# Altium schematic sheet mcu.SchDoc: MJVESC MINI - MCU
size A3; Author: Dongil Choi; Organization: DRC LAB, Myongji University; Address1: Engineering Building 1, #214; Address2: 116 Myongji-ro, Cheoin-Gu; Address3: Yongin-si, Gyeonggi-Do; Address4: South Korea, 17058; DocumentNumber: 1; Revision: 0.3A; SheetNumber: 1; SheetTotal: 3
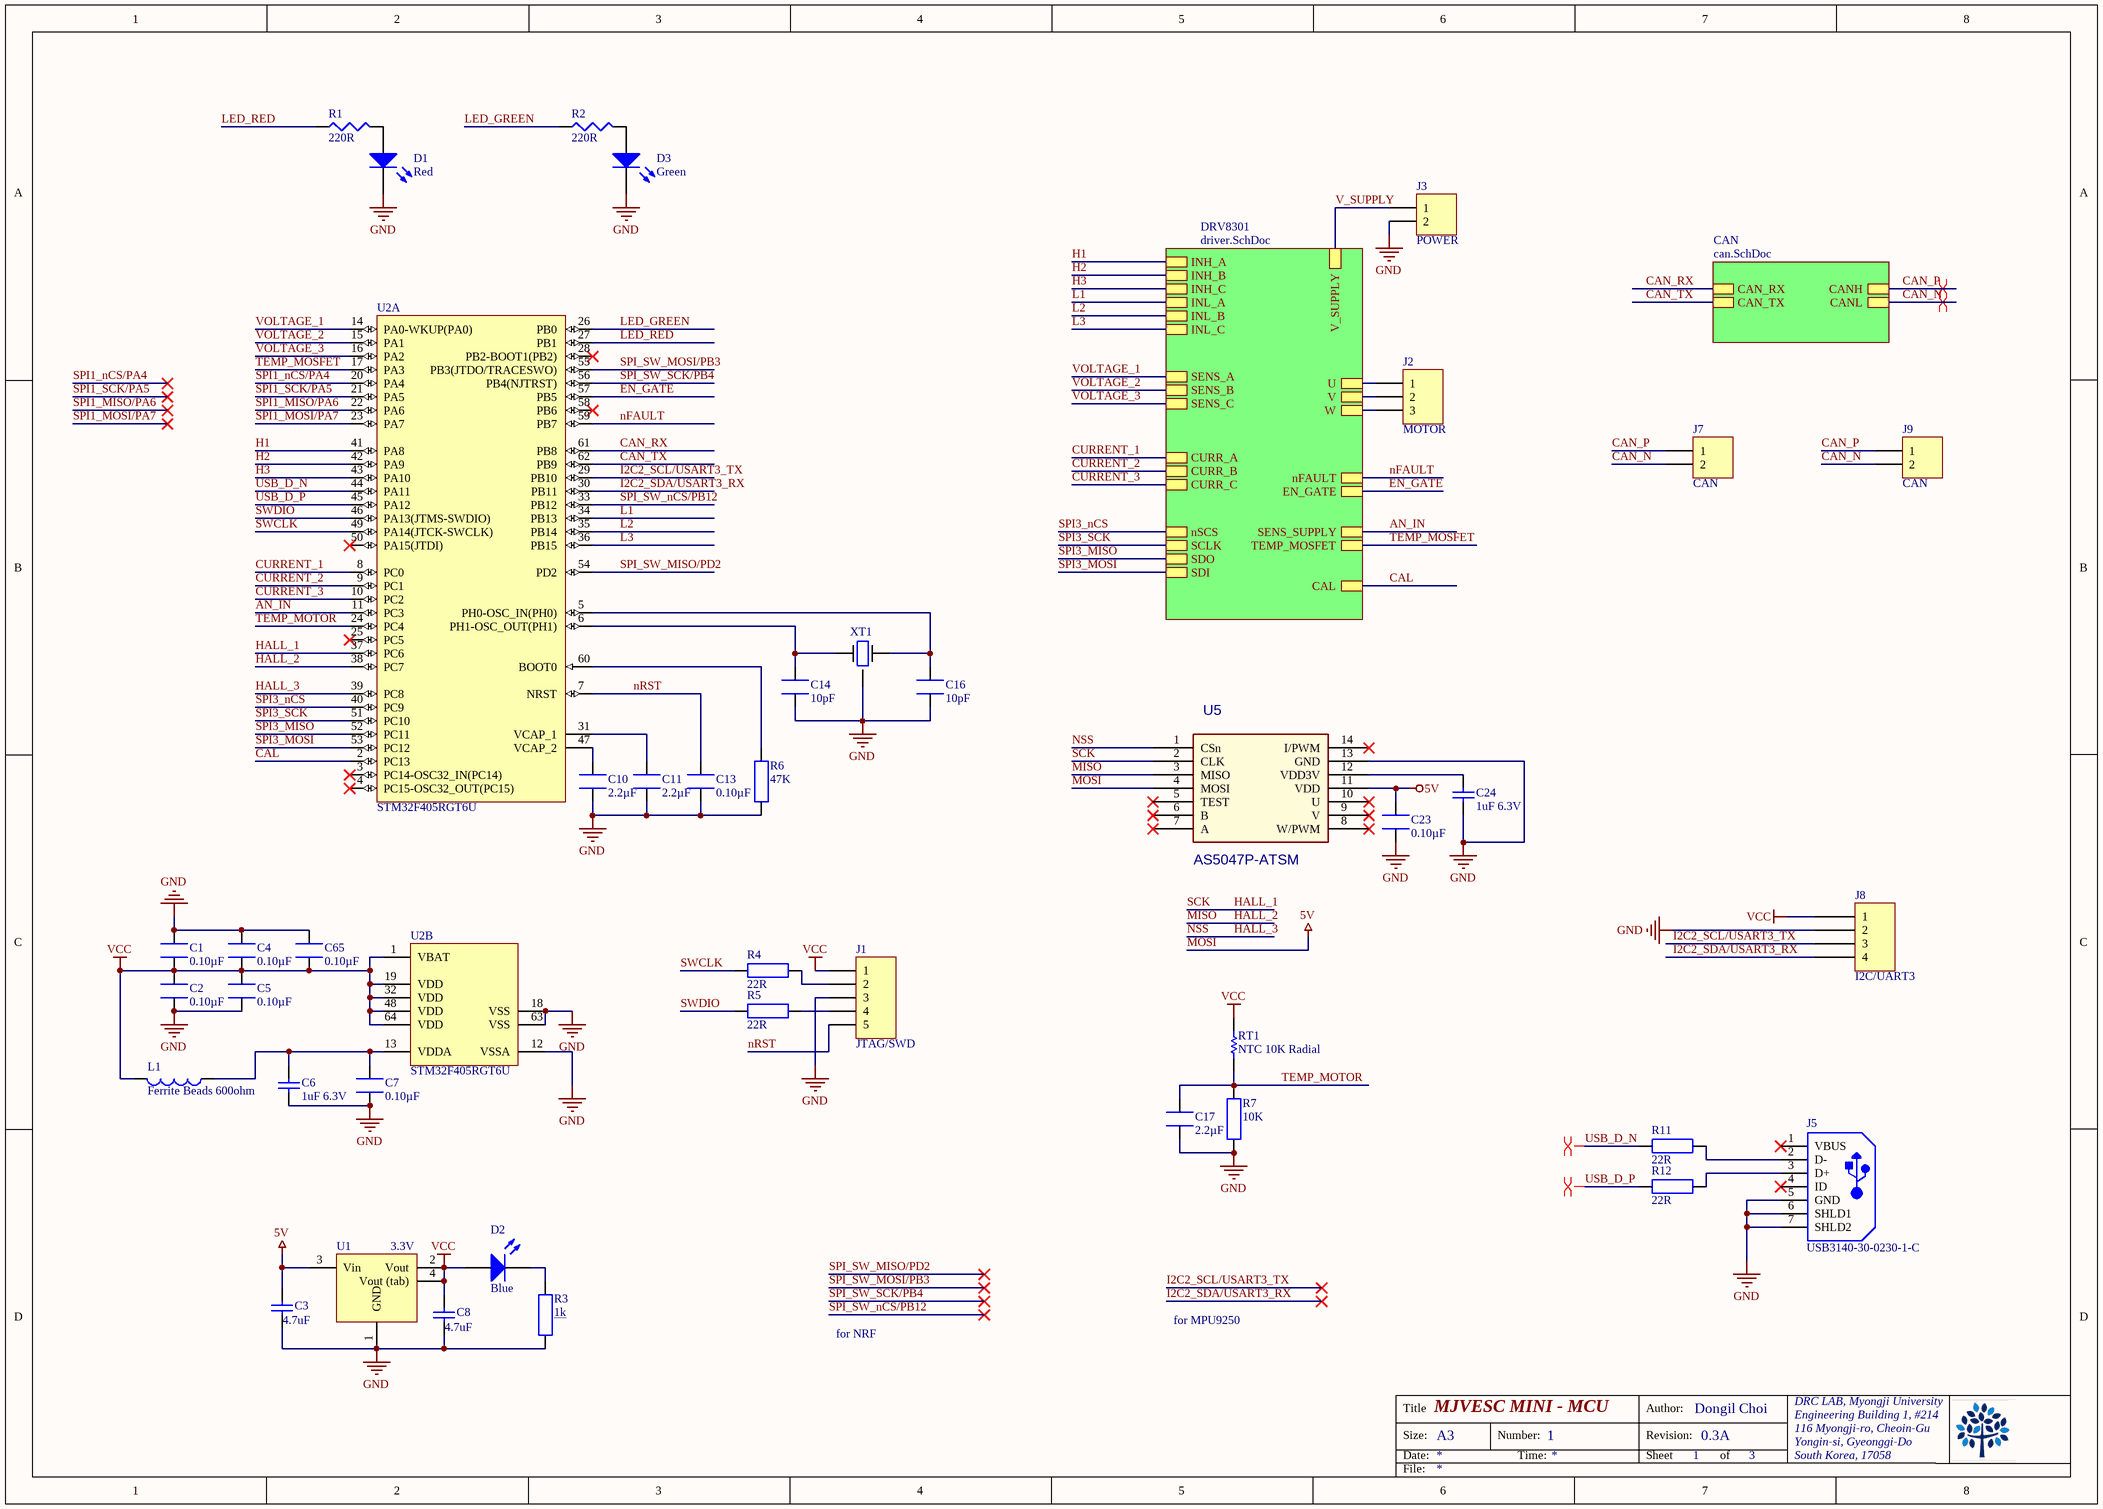
[diagram p0: mcu.SchDoc]

## Parts
C1  0.10µF  [CAP 0603/1608]
C2  0.10µF  [CAP 0603/1608]
C3  4.7uF  [CAPC0805(2012)145_N]
C4  0.10µF  [CAP 0603/1608]
C5  0.10µF  [CAP 0603/1608]
C6  1uF 6.3V  [CAPC0603(1608)100_N]
C7  0.10µF  [CAP 0603/1608]
C8  4.7uF  [CAPC0805(2012)145_N]
C10  2.2µF  [CAP 0603/1608]
C11  2.2µF  [CAP 0603/1608]
C13  0.10µF  [CAP 0603/1608]
C14  10pF  [CAP 0603/1608]
C16  10pF  [CAP 0603/1608]
C17  2.2µF  [CAP 0603/1608]
C23  0.10µF  [CAP 0603/1608]
C24  1uF 6.3V  [CAPC0603(1608)100_N]
C65  0.10µF  [CAP 0603/1608]
D1  Red  [LED 0603/1608 RED]
D2  Blue  [LED 0603/1608 BLUE]
D3  Green  [LED 0603/1608 GREEN]
J1  JTAG/SWD  [JST BM05B-GHS-TBT]
J2  MOTOR  [MR30PW - MIRROR]
J3  POWER  [XT30PW - MIRROR]
J5  USB3140-30-0230-1-C  [GCT-USB3140_V]
J7  CAN  [JST SM02B-GHS-TB]
J8  I2C/UART3  [JST BM04B-GHS-TBT]
J9  CAN  [JST SM02B-GHS-TB]
L1  Ferrite Beads 600ohm  [FER 0603/1608]
R1  220R  [RES 0603/1608]
R2  220R  [RES 0603/1608]
R3  1k  [RES 0603/1608]
R4  22R  [RES 0603/1608]
R5  22R  [RES 0603/1608]
R6  47K  [RES 0603/1608]
R7  10K  [RES 0603/1608]
R11  22R  [RES 0603/1608]
R12  22R  [RES 0603/1608]
RT1  NTC 10K Radial  [SEMI-103AT-2_V]
U1  3.3V  [SOT-223-2]
U2  STM32F405RGT6U  [STM-LQFP64_V]  (parts A,B of 2)
U5  AS5047P-ATSM  [AMS-TSSOP-14-5000X4400DE_M]
XT1  8 MHz  [DFN220P320X110-4N]  (value not drawn)

## Sub-sheets
CAN = can.SchDoc: CAN_TX, CAN_RX, CANH, CANL
DRV8301 = driver.SchDoc: EN_GATE, SENS_A, SENS_B, INH_A, INL_A, INH_B, INL_B, INH_C, INL_C, SENS_C, SENS_SUPPLY, CURR_C, CURR_B, CURR_A, U, V, W, V_SUPPLY, nSCS, SCLK, SDO, SDI, nFAULT, TEMP_MOSFET, CAL

## Nets
GND: C1.1 C2.2 C3.1 C4.1 C5.2 C6.2 C7.2 C8.1 C10.1 C11.1 C13.1 C14.2 C16.2 C17.1 C23.1 C24.2 C65.1 D1.2(K) D3.2(K) J1.3 J3.2 J5.5(GND) J5.6(SHLD1) J5.7(SHLD2) J8.2 R3.2 R6.1 R7.2 U1.1(GND) U2.12(VSSA) U2.18(VSS) U2.63(VSS) U5.13(GND) XT1.G
MOSI: C3.2 C23.2 U1.3(Vin) U5.4(MOSI) U5.11(VDD)  [also labelled 5V]
VCC: C1.2 C2.1 C4.2 C5.1 C8.2 C65.2 D2.1(A) J1.1 J8.1 L1.2 RT1.2 U1.2(Vout) U1.4(Vout_(tab)) U2.1(VBAT) U2.19(VDD) U2.32(VDD) U2.48(VDD) U2.64(VDD)
AN_IN: U2.11(PC3) ; sheet DRV8301/SENS_SUPPLY
CAL: U2.2(PC13) ; sheet DRV8301/CAL
CAN_N: J7.2 J9.2 ; sheet CAN/CANL
CAN_P: J7.1 J9.1 ; sheet CAN/CANH
CAN_RX: U2.61(PB8) ; sheet CAN/CAN_RX
CAN_TX: U2.62(PB9) ; sheet CAN/CAN_TX
CURRENT_1: U2.8(PC0) ; sheet DRV8301/CURR_A
CURRENT_2: U2.9(PC1) ; sheet DRV8301/CURR_B
CURRENT_3: U2.10(PC2) ; sheet DRV8301/CURR_C
EN_GATE: U2.57(PB5) ; sheet DRV8301/EN_GATE
H1: U2.41(PA8) ; sheet DRV8301/INH_A
H2: U2.42(PA9) ; sheet DRV8301/INH_B
H3: U2.43(PA10) ; sheet DRV8301/INH_C
HALL_1: U2.37(PC6) U5.2(CLK)  [also labelled SCK]
HALL_2: U2.38(PC7) U5.3(MISO)  [also labelled MISO]
HALL_3: U2.39(PC8) U5.1(CSn)  [also labelled NSS]
I2C2_SCL/USART3_TX: J8.3 U2.29(PB10)
I2C2_SDA/USART3_RX: J8.4 U2.30(PB11)
L1: U2.34(PB13) ; sheet DRV8301/INL_A
L2: U2.35(PB14) ; sheet DRV8301/INL_B
L3: U2.36(PB15) ; sheet DRV8301/INL_C
LED_GREEN: R2.1 U2.26(PB0)
LED_RED: R1.1 U2.27(PB1)
nFAULT: U2.59(PB7) ; sheet DRV8301/nFAULT
nRST: C13.2 J1.5 U2.7(NRST)
SPI1_MISO/PA6: U2.22(PA6)
SPI1_MOSI/PA7: U2.23(PA7)
SPI1_nCS/PA4: U2.20(PA4)
SPI1_SCK/PA5: U2.21(PA5)
SPI3_MISO: U2.52(PC11) ; sheet DRV8301/SDO
SPI3_MOSI: U2.53(PC12) ; sheet DRV8301/SDI
SPI3_nCS: U2.40(PC9) ; sheet DRV8301/nSCS
SPI3_SCK: U2.51(PC10) ; sheet DRV8301/SCLK
SPI_SW_MISO/PD2: U2.54(PD2)
SPI_SW_MOSI/PB3: U2.55(PB3(JTDO/TRACESWO))
SPI_SW_nCS/PB12: U2.33(PB12)
SPI_SW_SCK/PB4: U2.56(PB4(NJTRST))
SWCLK: R4.2 U2.49(PA14(JTCK-SWCLK))
SWDIO: R5.2 U2.46(PA13(JTMS-SWDIO))
TEMP_MOSFET: U2.17(PA3) ; sheet DRV8301/TEMP_MOSFET
TEMP_MOTOR: C17.2 R7.1 RT1.1 U2.24(PC4)
USB_D_N: R11.1 U2.44(PA11)
USB_D_P: R12.1 U2.45(PA12)
V_SUPPLY: J3.1 ; sheet DRV8301/V_SUPPLY
VOLTAGE_1: U2.14(PA0-WKUP(PA0)) ; sheet DRV8301/SENS_A
VOLTAGE_2: U2.15(PA1) ; sheet DRV8301/SENS_B
VOLTAGE_3: U2.16(PA2) ; sheet DRV8301/SENS_C
NetC6_1: C6.1 C7.1 L1.1 U2.13(VDDA)
NetC10_2: C10.2 U2.47(VCAP_2)
NetC11_2: C11.2 U2.31(VCAP_1)
NetC14_1: C14.1 U2.6(PH1-OSC_OUT(PH1)) XT1.1
NetC16_1: C16.1 U2.5(PH0-OSC_IN(PH0)) XT1.3
NetC24_1: C24.1 U5.12(VDD3V)
NetD1_1: D1.1(A) R1.2
NetD2_2: D2.2(K) R3.1
NetD3_1: D3.1(A) R2.2
NetJ1_2: J1.2 R4.1
NetJ1_4: J1.4 R5.1
NetJ2_1: J2.1 ; sheet DRV8301/U
NetJ2_2: J2.2 ; sheet DRV8301/V
NetJ2_3: J2.3 ; sheet DRV8301/W
NetJ5_2: J5.2(D-) R11.2
NetJ5_3: J5.3(D+) R12.2
NetR6_2: R6.2 U2.60(BOOT0)

Not connected (* = marked no-connect by the designer): J5 1(VBUS)* 4(ID)*; U2 3(PC14-OSC32_IN(PC14))* 4(PC15-OSC32_OUT(PC15))* 25(PC5)* 28(PB2-BOOT1(PB2))* 50(PA15(JTDI))* 58(PB6)*; U5 5(TEST)* 6(B)* 7(A)* 8(W/PWM)* 9(V)* 10(U)* 14(I/PWM)*

## Layout directives
differential pair: CAN_N, CAN_P, USB_D_N, USB_D_P

## Notes on the sheet
- for MPU9250
- for NRF
- Title
- Size:
- Date:
- A3
- Number:
- Time:
- Revision:
- Sheet
- Author:
- of
- File:

## Library data of the parts
C1 C2 C4 C5 C7 C13 C23 C65 = GRM188R71E104KA01D: CAP CER 0.1UF 25V X7R 0603; Manufacturer: Murata Electronics North America; Tolerance: ±10%; Supplier 1: Digi-Key; Supplier Part Number 1: 490-1524-1-ND; Manufacturer Part Number: GRM188R71E104KA01D; RoHS: RoHS Compliant; Category: Capacitors; Stock 1: 1667481; Pricing 1: 1=0.1, 10=0.019, 50=0.0104, 100=0.0088, 250=0.0072, 500=0.00616, 1000=0.0048 (USD); Packaging: Cut Tape (CT); Capacitance: 0.10µF; Voltage - Rated: 25V; Temperature Coefficient: X7R; Mounting Type: Surface Mount, MLCC; Operating Temperature: -55°C ~ 125°C; Applications: General Purpose; Ratings: -; Package / Case: 0603 (1608 Metric); Size / Dimension: 0.063" L x 0.031" W (1.60mm x 0.80mm); Height - Seated (Max): -; Thickness (Max): 0.035" (0.90mm); Lead Spacing: -; Features: -; Lead Style: -; ComponentLink1URL: http://www.murata.com/~/media/webrenewal/support/library/catalog/products/capacitor/mlcc/c02e.pdf; ComponentLink1Description: http://www.murata.com/~/media/webrenewal/support/library/catalog/products/capacitor/mlcc/c02e.pdf; PartNumber: GRM188R71E104KA01D
C3 C8 = CMP-1036-04898-1: CAP 4.7uF 35V ±10% 0805 (2012 Metric) Thickness 1.45mm SMD; PartNumber: GRM219R6YA475KA73D; Case-Metric: 2012; Tolerance: Â±10%; Case-EIA: 0805; Max Thickness: 1.45 mm; Technology: SMT; Value: 4.7uF; Rated Voltage: 35 V
C6 C24 = CMP-1035-02730-1: CAP 1uF 6.3V ±10% 0603 (1608 Metric) Thickness 1mm SMD; PartNumber: CC0603KRX7R5BB105; Case-EIA: 0603; Case-Metric: 1608; Tolerance: Â±10%; Rated Voltage: 6.3 V; Max Thickness: 1 mm; Technology: SMT; Value: 1uF
C10 C11 C17 = GRM188R61C225KE15D: CAP CER 2.2UF 16V X5R 0603; Manufacturer: Murata Electronics North America; Tolerance: ±10%; Supplier 1: Digi-Key; Supplier Part Number 1: 490-3296-1-ND; Manufacturer Part Number: GRM188R61C225KE15D; RoHS: RoHS Compliant; Category: Capacitors; Stock 1: 1255740; Pricing 1: 1=0.12, 10=0.08, 50=0.046, 100=0.038, 250=0.032, 500=0.0268, 1000=0.022 (USD); Packaging: Cut Tape (CT); Capacitance: 2.2µF; Voltage - Rated: 16V; Temperature Coefficient: X5R; Mounting Type: Surface Mount, MLCC; Operating Temperature: -55°C ~ 85°C; Applications: General Purpose; Ratings: -; Package / Case: 0603 (1608 Metric); Size / Dimension: 0.063" L x 0.031" W (1.60mm x 0.80mm); Height - Seated (Max): -; Thickness (Max): 0.035" (0.90mm); Lead Spacing: -; Features: -; Lead Style: -; ComponentLink1URL: http://www.murata.com/~/media/webrenewal/support/library/catalog/products/capacitor/mlcc/c02e.pdf; ComponentLink1Description: http://www.murata.com/~/media/webrenewal/support/library/catalog/products/capacitor/mlcc/c02e.pdf; PartNumber: GRM188R61C225KE15D
C14 C16 = GRM1885C1H100JA01D: CAP CER 10PF 50V NP0 0603; Manufacturer: Murata Electronics North America; Tolerance: ±5%; Temperature Coefficient: C0G, NP0; Supplier 1: Digi-Key; Supplier Part Number 1: 490-1403-1-ND; Manufacturer Part Number: GRM1885C1H100JA01D; RoHS: RoHS Compliant; Category: Capacitors; Stock 1: 450321; Pricing 1: 1=0.1, 10=0.041, 50=0.0222, 100=0.0187, 250=0.01532, 500=0.0131, 1000=0.0102 (USD); Packaging: Cut Tape (CT); Capacitance: 10pF; Voltage - Rated: 50V; Mounting Type: Surface Mount, MLCC; Operating Temperature: -55°C ~ 125°C; Applications: General Purpose; Ratings: -; Package / Case: 0603 (1608 Metric); Size / Dimension: 0.063" L x 0.031" W (1.60mm x 0.80mm); Height - Seated (Max): -; Thickness (Max): 0.035" (0.90mm); Lead Spacing: -; Features: -; Lead Style: -; ComponentLink1URL: http://www.murata.com/~/media/webrenewal/support/library/catalog/products/capacitor/mlcc/c02e.pdf; ComponentLink1Description: http://www.murata.com/~/media/webrenewal/support/library/catalog/products/capacitor/mlcc/c02e.pdf; PartNumber: GRM1885C1H100JA01D
D1 = LED0: Typical INFRARED GaAs LED; PartNumber: LTST-C191KRKT; Published: 8-Jun-2000; LatestRevisionDate: 08-Jul-2005; LatestRevisionNote: Mech Layer 1 removed.; PackageReference: LED-0; Publisher: Altium Limited; PackageDescription: LED; 2 Leads
D2 = LED0: Typical INFRARED GaAs LED; PartNumber: LTST-C191TBKT; Published: 8-Jun-2000; LatestRevisionDate: 08-Jul-2005; LatestRevisionNote: Mech Layer 1 removed.; PackageReference: LED-0; Publisher: Altium Limited; PackageDescription: LED; 2 Leads
D3 = LED0: Typical INFRARED GaAs LED; PartNumber: LTST-C191KGKT; Published: 8-Jun-2000; LatestRevisionDate: 08-Jul-2005; LatestRevisionNote: Mech Layer 1 removed.; PackageReference: LED-0; Publisher: Altium Limited; PackageDescription: LED; 2 Leads
J1 = JST BM05B-GHS-TBT: JST GH Connector, 5Pin, Vertical; LatestRevisionDate: 17-Jul-2002; LatestRevisionNote: Re-released for DXP Platform.; Publisher: Altium Limited; PartNumber: BM05B-GHS-TBT
J2 = MR30PW-M: AMASS, MR30,  on PCBs, 30A 500V, UL94V, -20...120°C; Parameter 1: XT30PW-M; LatestRevisionDate: 17-Jul-2002; LatestRevisionNote: Re-released for DXP Platform.; Publisher: Altium Limited
J3 = XT30PW-M: AMASS, XT30,  on PCBs, 30A 500V, UL94V, -20...120°C; LatestRevisionDate: 17-Jul-2002; LatestRevisionNote: Re-released for DXP Platform.; Publisher: Altium Limited; Parameter 1: XT30PW-M
J5 = CMP-2000-07368-1: Micro USB Receptacle, Type B, SMT, Vertical, with Through-Hole Shell Stakes, -30 to 85 degC, 5-Pin SMD, RoHS, Tape and Reel; Manufacturer: Global Connector Technology; Connector Mounting: PCB; SVHC: NoSVHC(19-Dec-2012); No. of Positions: 5; Connector Type: USB2.0MicroB; No. of Rows: 1; Contact Termination: SurfaceMountVertical; Pitch: 0.65mm; Contact Material: Copper; Gender: Receptacle; PartNumber: USB3140; Series: USB3140; Datasheet URL: http://www.farnell.com/datasheets/1913332.pdf; Contact Plating: Gold; Manufacturer URL: http://gct.co/; Package Reference: USB3140; No. of Contacts: 5; Orientation: Vertical; Datasheet Version: Rev. B2, 04/2015; Package Description: 5-Pin Surface Mount Device, Body 7.8 x 4 mm, Pitch 0.65 mm; Mounting Technology: SurfaceMount
J7 J9 = JST SM02B-GH: JST GH Connector, 2Pin; PartNumber: SM02B-GHS-TB(LF)(SN); LatestRevisionDate: 17-Jul-2002; LatestRevisionNote: Re-released for DXP Platform.; Publisher: Altium Limited
J8 = JST BM04B-GH: JST GH Connector, 4Pin; PartNumber: BM04B-GHS-TB(LF)(SN)
L1 = Inductor: Ferrite Beads 600MHz 0.015Ohm 25% 1608 AEC-Q200; PartNumber: KPZ1608SHR601ATD25; Code_IEC: 1005; Value: 10mH; Published: 8-Jun-2000; LatestRevisionDate: 29-May-2009; LatestRevisionNote: IPC-7351 Footprint Added.; PackageReference: 0402-A; Publisher: Altium Limited; PackageDescription: Chip Inductor; Code_JEITA: 0402
R1 R2 = Res3: RES SMD 220R OHM 1% 1/10W 0603; PartNumber: RC0603FR-10220RL; Published: 8-Jun-2000; LatestRevisionDate: 29-May-2009; LatestRevisionNote: IPC-7351 Footprint Added.; PackageReference: J1-0603; Publisher: Altium Limited; PackageDescription: Chip Resistor; Value: 220R
R3 = RC0603FR-071KL: RES SMD 1K OHM 1% 1/10W 0603; Manufacturer: Yageo; Power (Watts): 0.1W, 1/10W; Temperature Coefficient: ±100ppm/°C; Supplier 1: Digi-Key; Supplier Part Number 1: 311-1.00KHRCT-ND; RoHS: RoHS Compliant; Category: Resistors; Stock 1: 6734836; Pricing 1: 1=0.1, 10=0.014, 25=0.01, 100=0.0057, 250=0.00436, 500=0.00348, 1000=0.00257, 2500=0.00223 (USD); Packaging: Cut Tape (CT); Tolerance: ±1%; Composition: Thick Film; Features: Moisture Resistant; Operating Temperature: -55°C ~ 155°C; Package / Case: 0603 (1608 Metric); Supplier Device Package: 0603; Size / Dimension: 0.063" L x 0.031" W (1.60mm x 0.80mm); Height: 0.022" (0.55mm); Number of Terminations: 2; ComponentLink1URL: http://www.yageo.com/documents/recent/PYu-RC_Group_51_RoHS_L_04.pdf; ComponentLink1Description: http://www.yageo.com/documents/recent/PYu-RC_Group_51_RoHS_L_04.pdf; Manufacturer Part Number: RC0603FR-071KL; Resistance (Ohms): 1k; PartNumber: RC0603FR-071KL
R4 R5 R11 R12 = RC0603FR-0722RL: RES SMD 22 OHM 1% 1/10W 0603; Manufacturer: Yageo; Resistance (Ohms): 22; Power (Watts): 0.1W, 1/10W; Temperature Coefficient: ±100ppm/°C; Supplier 1: Digi-Key; Supplier Part Number 1: 311-22.0HRCT-ND; Manufacturer Part Number: RC0603FR-0722RL; RoHS: RoHS Compliant; Category: Resistors; Stock 1: 575303; Pricing 1: 1=0.1, 10=0.014, 25=0.01, 100=0.0057, 250=0.00436, 500=0.00348, 1000=0.00257, 2500=0.00223 (USD); Packaging: Cut Tape (CT); Tolerance: ±1%; Composition: Thick Film; Features: Moisture Resistant; Operating Temperature: -55°C ~ 155°C; Package / Case: 0603 (1608 Metric); Supplier Device Package: 0603; Size / Dimension: 0.063" L x 0.031" W (1.60mm x 0.80mm); Height: 0.022" (0.55mm); Number of Terminations: 2; ComponentLink1URL: http://www.yageo.com/documents/recent/PYu-RC_Group_51_RoHS_L_04.pdf; ComponentLink1Description: http://www.yageo.com/documents/recent/PYu-RC_Group_51_RoHS_L_04.pdf; PartNumber: RC0603FR-0722RL
R6 = RC0603FR-0747KL: RES SMD 47K OHM 1% 1/10W 0603; Manufacturer: Yageo; Power (Watts): 0.1W, 1/10W; Temperature Coefficient: ±100ppm/°C; Supplier 1: Digi-Key; Supplier Part Number 1: 311-47.0KHRCT-ND; Manufacturer Part Number: RC0603FR-0747KL; RoHS: RoHS Compliant; Category: Resistors; Stock 1: 930868; Pricing 1: 1=0.1, 10=0.014, 25=0.01, 100=0.0057, 250=0.00436, 500=0.00348, 1000=0.00257, 2500=0.00223 (USD); Packaging: Cut Tape (CT); Resistance (Ohms): 47k; Tolerance: ±1%; Composition: Thick Film; Features: Moisture Resistant; Operating Temperature: -55°C ~ 155°C; Package / Case: 0603 (1608 Metric); Supplier Device Package: 0603; Size / Dimension: 0.063" L x 0.031" W (1.60mm x 0.80mm); Height: 0.022" (0.55mm); Number of Terminations: 2; ComponentLink1URL: http://www.yageo.com/documents/recent/PYu-RC_Group_51_RoHS_L_04.pdf; ComponentLink1Description: http://www.yageo.com/documents/recent/PYu-RC_Group_51_RoHS_L_04.pdf; PartNumber: RC0603FR-0747KL
R7 = RC0603FR-0710KL: RES SMD 10K OHM 1% 1/10W 0603; Manufacturer: Yageo; Power (Watts): 0.1W, 1/10W; Temperature Coefficient: ±100ppm/°C; Supplier 1: Digi-Key; Supplier Part Number 1: 311-10.0KHRCT-ND; Manufacturer Part Number: RC0603FR-0710KL; RoHS: RoHS Compliant; Category: Resistors; Stock 1: 13504930; Pricing 1: 1=0.1, 10=0.014, 25=0.01, 100=0.0057, 250=0.00436, 500=0.00348, 1000=0.00257, 2500=0.00223 (USD); Packaging: Cut Tape (CT); Resistance (Ohms): 10k; Tolerance: ±1%; Composition: Thick Film; Features: Moisture Resistant; Operating Temperature: -55°C ~ 155°C; Package / Case: 0603 (1608 Metric); Supplier Device Package: 0603; Size / Dimension: 0.063" L x 0.031" W (1.60mm x 0.80mm); Height: 0.022" (0.55mm); Number of Terminations: 2; ComponentLink1URL: http://www.yageo.com/documents/recent/PYu-RC_Group_51_RoHS_L_04.pdf; ComponentLink1Description: http://www.yageo.com/documents/recent/PYu-RC_Group_51_RoHS_L_04.pdf; PartNumber: RC0603FR-0710KL
RT1 = CMP-2000-05824-1: NTC Thermistors 10Kohms 5% Radial / NTCLE100E3103JT2 (Vishay - cheap); Brand: Semitec; Tolerance: 1%; Packaging: Bulk; Mounting Technology: ThroughHole; Operating Temperature Range: -50Cto+110C; Lead Spacing: 2.54mm; RoHS: True; Manufacturer URL: http://www.semitec.co.jp/english/; Datasheet Version: Rev. A, 02/2007; Length: 17mm; Manufacturer: Semitec; Resistance: 10kOhms; Termination Style: Radial; Datasheet URL: https://www.rapidonline.com/pdf/61-0500e.pdf; Product Category: Thermistors-NTC; Series: AT; Package Description: 2-Pin Through Hole Device, Body Width 3.8 mm (Max), Pitch 2.54 mm; Width: 3.7mm; Type: NTC; Package Reference: 103AT-2; Height: 2.4mm; PartNumber: NTCLE100E3103JT2
U1 = AZ1117EH-3.3TRG1: IC REG LDO 3.3V 1A SOT223; Manufacturer: Diodes Incorporated; Regulator Topology: Positive Fixed; Voltage - Dropout (Typical): 1.1V @ 1A; Voltage - Input: Up to 13V; Supplier 1: Digi-Key; Supplier Part Number 1: AZ1117EH-3.3TRG1DICT-ND; RoHS: RoHS Compliant; Category: Integrated Circuits (ICs); Stock 1: 22748; Pricing 1: 1=0.43, 10=0.321, 100=0.1815, 500=0.12022, 1000=0.09216 (USD); Packaging: Cut Tape (CT); Part Status: Active; Voltage - Output: 3.3V; Current - Output: 1A; Current - Limit (Min): -; Operating Temperature: -40°C ~ 125°C; Mounting Type: Surface Mount; Package / Case: TO-261-4, TO-261AA; Supplier Device Package: SOT-223; ComponentLink1URL: http://www.diodes.com/assets/Datasheets/AZ1117E.pdf; ComponentLink1Description: http://www.diodes.com/assets/Datasheets/AZ1117E.pdf; PartNumber: AZ1117EH-3.3TRG1
U2 = STM32F405RGT6: ARM Cortex-M4 32-bit MCU+FPU, 210 DMIPS, 1024 kB Flash, 192 kB Internal RAM, 51 I/Os, 64-pin LQFP, -40 to 85 degC, Tray; Manufacturer: STMicroelectronics; Operating Frequency(F) (Processor speed) (MHz): 168; Internal RAM Size (kB): 192; FLASH Size (Prog) (kB): 1024; Supply Voltage(Vcc) min (V): 1.8; I/Os (High Current): 51; D/A Converter: 2x12-bit; Supply Voltage(Vcc) max (V): 3.6; ComponentLink1Description: Manufacturer URL; PackageDescription: 64-Pin Low Profile Quad Flat Package, 10 x 10 mm Body, 0.5 mm Pitch; Mounting Technology: Surface Mount; ComponentLink2URL: http://www.st.com/st-web-ui/static/active/en/resource/technical/document/datasheet/DM00037051.pdf; ComponentLink1URL: http://www.st.com/web/en/home.html; PartNumber: STM32F405RGT6U; ComponentLink2Description: Datasheet; ComponentLink3URL: http://www.st.com/st-web-ui/static/active/en/resource/technical/document/datasheet/DM00037051.pdf; Core: ARM Cortex-M4; PackageReference: LQFP64; ComponentLink3Description: Package Specification; DatasheetVersion: Rev. 4; Packing: Tray; PackageVersion: Rev. 4, 06/2013
U5 = AS5147: AS5147-HTSM; PartNumber: AS5047P-ATSM
XT1 = ABM3B-8.000MHZ-10-1-U-T: Crystal 8MHz ±10ppm 10pF 200 Ohm -10°C ~ 60°C Surface Mount 4-SMD, No Lead (DFN, LCC); PartNumber: ABM3B-8.000MHZ-10-1UT